# Altium schematic sheet IO_Peripherals.SchDoc: IO Peripherals
size A4; Revision: 1.0; SheetNumber: 7; SheetTotal: 7
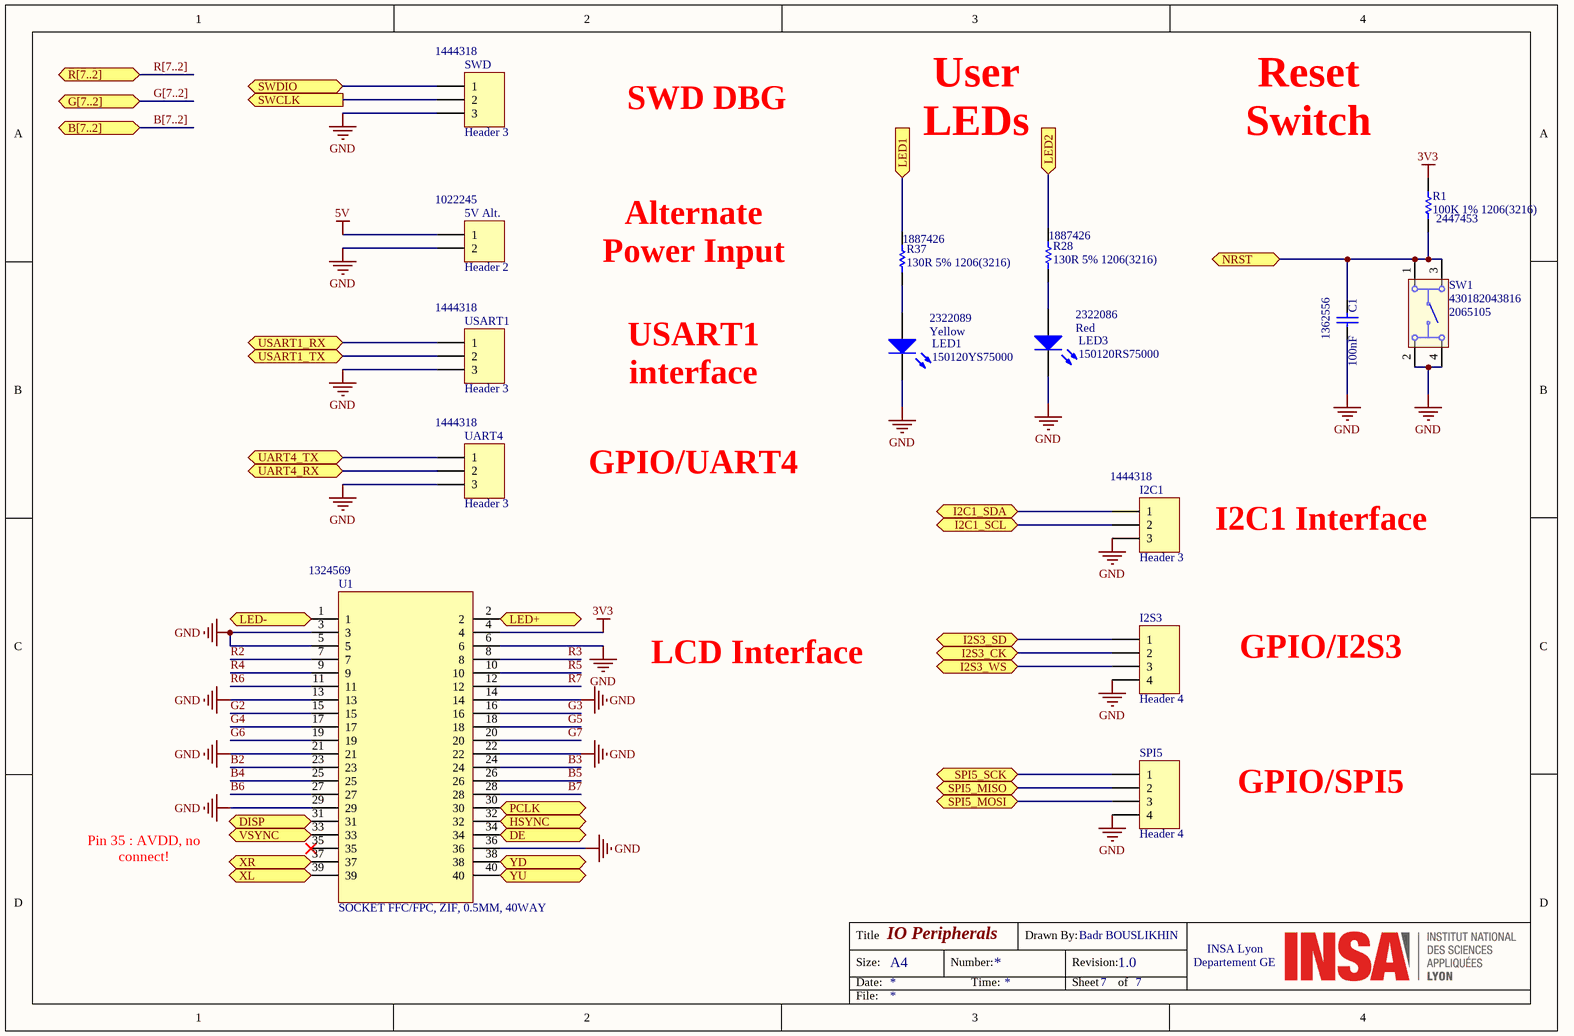
[diagram p0: IO_Peripherals.SchDoc]

## Parts
5V_Alt.  Header 2  Supplier Part Number 1: 1022245  [HDR1X2]
C1  100nF  Supplier Part Number 1: 1362556  [CAPC0603(1608)100_N]
I2C1  Header 3  Supplier Part Number 1: 1444318  [HDR1X3]
I2S3  Header 4  [HDR1X4]
LED1  150120YS75000  Color: Yellow  Supplier Part Number 1: 2322089  [1206_A]
LED3  150120RS75000  Color: Red  Supplier Part Number 1: 2322086  [1206_A]
R1  100K 1% 1206(3216)  Supplier Part Number 1: 2447453  [RESC1206(3216)_L]
R28  130R 5% 1206(3216)  Supplier Part Number 1: 1887426  [RESC1206(3216)_L]
R37  130R 5% 1206(3216)  Supplier Part Number 1: 1887426  [RESC1206(3216)_L]
SPI5  Header 4  [HDR1X4]
SW1  430182043816  Supplier Part Number 1: 2065105  [430182043816]
SWD  Header 3  Supplier Part Number 1: 1444318  [HDR1X3]
U1  SOCKET FFC/FPC, ZIF, 0.5MM, 40WAY  Supplier Part Number 1: 1324569  [HIROSE_FH12S-40S-0.5SH(55)]
UART4  Header 3  Supplier Part Number 1: 1444318  [HDR1X3]
USART1  Header 3  Supplier Part Number 1: 1444318  [HDR1X3]

## Ports
B[7..2], DE (in), DISP (in), G[7..2], HSYNC, I2C1_SCL, I2C1_SDA, I2S3_CK, I2S3_SD, I2S3_WS, LED1 (in), LED2 (in), LED+, LED-, NRST (bidir), PCLK (in), R[7..2], SPI5_MISO, SPI5_MOSI, SPI5_SCK, SWCLK (out), SWDIO (bidir), UART4_RX, UART4_TX, USART1_RX, USART1_TX, VSYNC, XL, XR, YD, YU

## Nets
3V3: R1.2 U1.4
5V: 5V_Alt..1
GND: 5V_Alt..2 C1.1 I2C1.3 I2S3.4 LED1.1(K) LED3.1(K) SPI5.4 SW1.2 SW1.4 SWD.3 U1.3 U1.5 U1.6 U1.13 U1.14 U1.21 U1.22 U1.29 U1.36 UART4.3 USART1.3
B2: U1.23
B3: U1.24
B4: U1.25
B5: U1.26
B6: U1.27
B7: U1.28
DE: U1.34 ; port DE
DISP: U1.31 ; port DISP
G2: U1.15
G3: U1.16
G4: U1.17
G5: U1.18
G6: U1.19
G7: U1.20
HSYNC: U1.32 ; port HSYNC
I2C1_SCL: I2C1.2 ; port I2C1_SCL
I2C1_SDA: I2C1.1 ; port I2C1_SDA
I2S3_CK: I2S3.2 ; port I2S3_CK
I2S3_SD: I2S3.1 ; port I2S3_SD
I2S3_WS: I2S3.3 ; port I2S3_WS
LED1: R37.2 ; port LED1
LED2: R28.2 ; port LED2
LED+: U1.2 ; port LED+
LED-: U1.1 ; port LED-
NRST: C1.2 R1.1 SW1.1 SW1.3 ; port NRST
PCLK: U1.30 ; port PCLK
R2: U1.7
R3: U1.8
R4: U1.9
R5: U1.10
R6: U1.11
R7: U1.12
SPI5_MISO: SPI5.2 ; port SPI5_MISO
SPI5_MOSI: SPI5.3 ; port SPI5_MOSI
SPI5_SCK: SPI5.1 ; port SPI5_SCK
SWCLK: SWD.2 ; port SWCLK
SWDIO: SWD.1 ; port SWDIO
UART4_RX: UART4.2 ; port UART4_RX
UART4_TX: UART4.1 ; port UART4_TX
USART1_RX: USART1.1 ; port USART1_RX
USART1_TX: USART1.2 ; port USART1_TX
VSYNC: U1.33 ; port VSYNC
XL: U1.39 ; port XL
XR: U1.37 ; port XR
YD: U1.38 ; port YD
YU: U1.40 ; port YU
NetLED1_2: LED1.2(A) R37.1
NetLED3_2: LED3.2(A) R28.1

Not connected (* = marked no-connect by the designer): U1 35*

## Buses and harness runs
bus B[7..2] = port B[7..2]
bus G[7..2] = port G[7..2]
bus R[7..2] = port R[7..2]

## Notes on the sheet
- SWD DBG
- User LEDs
- (near R1) Reset Switch
- Alternate Power Input
- USART1 interface
- GPIO/UART4
- I2C1 Interface
- LCD Interface
- GPIO/I2S3
- GPIO/SPI5
- Pin 35 : AVDD, no connect!
- Title
- Size:
- Date:
- A4
- Number:
- Time:
- Drawn By:
- Revision:
- Sheet
- Badr BOUSLIKHIN
- of
- Departement GE
- INSA Lyon
- File:

## Library data of the parts
5V_Alt. = Header 2: Header, 2-Pin; LatestRevisionDate: 17-Jul-2002; LatestRevisionNote: Re-released for DXP Platform.; Publisher: Altium Limited; Supplier 1: Farnell
C1 = CMP-1035-02592-1: CAP 100nF 50V ±10% 0603 (1608 Metric) Thickness 1mm SMD; Case-EIA: 0603; Case-Metric: 1608; Technology: SMT; Rated Voltage: 50 V; Max Thickness: 1 mm; Tolerance: ±10%; Value: 100nF; Supplier 1: Farnell
I2C1 SWD UART4 USART1 = Header 3: Header, 3-Pin; LatestRevisionDate: 17-Jul-2002; LatestRevisionNote: Re-released for DXP Platform.; Publisher: Altium Limited; Supplier 1: Farnell
I2S3 SPI5 = Header 4: Header, 4-Pin; LatestRevisionDate: 17-Jul-2002; LatestRevisionNote: Re-released for DXP Platform.; Publisher: Altium Limited
LED1 = CMP-1426-00019-1: SMD mono-color Chip LED, WL-SMCW, Yellow; Manufacturer: Wuerth Elektronik; PackageReference: 1206_A; PartNumber: 150120YS75000; ComponentLink1Description: Manufacturer URL; ComponentLink2URL: http://katalog.we-online.com/led/datasheet/150120YS75000.pdf; ComponentLink2Description: Datasheet; ComponentLink1URL: http://www.we-online.com; Supplier 1: Farnell
LED3 = CMP-1426-00013-1: SMD mono-color Chip LED, WL-SMCW, Red; Manufacturer: Wuerth Elektronik; ComponentLink2URL: http://katalog.we-online.com/led/datasheet/150120RS75000.pdf; ComponentLink2Description: Datasheet; ComponentLink1Description: Manufacturer URL; ComponentLink1URL: http://www.we-online.com; PartNumber: 150120RS75000; PackageReference: 1206_A; Supplier 1: Farnell
R1 = CMP-1014-00736-1: 100K 0.25W 1% 1206 (3216 Metric)  SMD; Manufacturer: YAGEO (PHYCOMP); Manufacturer Part Number: RC1206FR-07100KL; Case-EIA: 1206; Value: 100000.00 Ohm; Case-Metric: 3216; Tolerance: 1 %; Power: 0.25 W; Technology: SMT; RoHS: YES; ComponentLink1URL: http://www.farnell.com/datasheets/444357.pdf; ComponentLink1Description: http://www.farnell.com/datasheets/444357.pdf; Supplier 1: Farnell
R28 R37 = CMP-1014-00053-1: 130R 0.25W 5% 1206 (3216 Metric)  SMD; Case-Metric: 3216; Value: 130.00 Ohm; Case-EIA: 1206; Tolerance: 5 %; Technology: SMT; Power: 0.25 W; Supplier 1: Farnell
SW1 = CMP-1452-00013-1: WS-TASV SMD Tact Switch 6X6 mm; Manufacturer: Wuerth Elektronik; NoPins: 04; ComponentLink2Description: Datasheet; PackageReference: 430182043816; ComponentLink2URL: http://katalog.we-online.de/em/datasheet/4301x2.pdf; ComponentLink1URL: http://www.we-online.com; PartNumber: 430182043816; ComponentLink1Description: Manufacturer URL; Supplier 1: Farnell
U1 = FH12S-40S-0.5SH(55): MPN: FH12S-40S-0.5SH(55); OC_FARNELL: 1324588; OC_NEWARK: 34M6197; PACKAGE: SOCKET FFC/FPC, ZIF, 0.5MM, 40WAY; SUPPLIER: Hirose; Supplier 1: Farnell